# Altium schematic sheet Alimentacion.SchDoc
size A4; SheetNumber: 4; SheetTotal: 4
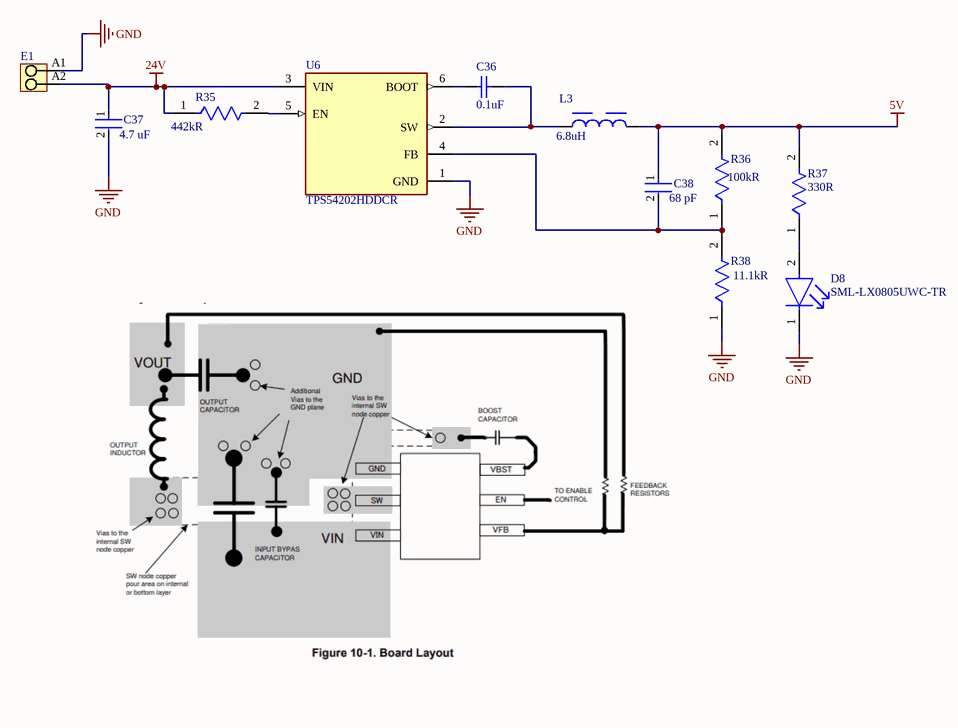
[diagram p0: Alimentacion.SchDoc]

## Parts
C36  value 0.1uF  [CAPC1005X60X30ML05T10]  (hidden comment: C0402C104M9RACTU)
C37  value 4.7 uF  [FP-CC0805-0_85-MFG]  (hidden comment: CC0805KKX5R9BB475)
C38  value 68 pF  [FP-C0402-BB-MFG]  (hidden comment: C0402C680J5HACTU)
D8  SML-LX0805UWC-TR  [FP-SML-LX0805UWC-TR-MFG]
E1  1330710000  [LMF_5_08_90_02]  (value not drawn)
L3  value 6.8uH  [WE-MAPI_3020]  (hidden comment: 74438336068HT)
R35  Resistance: 442kR  [FP-CRCW0603-e3-IPC_C]  (hidden comment: CRCW0603442KFKEC)
R36  Resistance: 100kR  [FP-CRGP0603-IPC_C]  (hidden comment: CRGP0603F100K)
R37  Resistance: 330R  [FP-AC0603-IPC_C]  (hidden comment: AC0603JR-07330RL)
R38  value 11.1kR  [FP-RN73R1E-IPC_A]  (hidden comment: RN73R1ETTP1112B25)
U6  TPS54202HDDCR  [FP-DDC0006A-IPC_B]

## Nets
5V: C38.1 L3.2 R36.2 R37.2
24V: C37.1 E1.A2 R35.1 U6.3(VIN)
GND: C37.2 D8.1(C) E1.A1 R38.1 U6.1(GND)
NetC36_1: C36.1 L3.1 U6.2(SW)
NetC36_2: C36.2 U6.6(BOOT)
NetC38_2: C38.2 R36.1 R38.2 U6.4(FB)
NetD8_2: D8.2(A) R37.1
NetR35_2: R35.2 U6.5(EN)

## Library data of the parts
C36 = CMP-2008-02199-1: Manufacturer: Kemet; Part Number: C0402C104M9RACTU
C37 = CMP-03422-000966-1: CAP CER 4.7UF 50V X5R 0805; Manufacturer: Yageo; Tolerance: 0.1; Material: Ceramic; Capacitance: 4.7 uF; Height: 0.95mm; Category: Cap; Manufacturer Part Number: CC0805KKX5R9BB475; ComponentLink2Description: Datasheet; Lead Free: Yes; Voltage Rating: 50 V; Device Class L2: Capacitors; Temperature Range High: +85°C; ComponentLink2URL: http://www.yageo.com/documents/recent/UPY-GPHC_Y5V_6.3V-to-50V_8.pdf; Ipc Land Pattern Name: CAPC200125X85; Octopart: https://octopart.com/cc0805kkx5r9bb475-yageo-81932641; Temperature Range Low: -30°C; Digikey Description: CAP CER 4.7UF 50V X5R 0805; Package: CC0805-0.85; Device Class L1: Passive Components; RoHS: TRUE; Temperature Characteristic: X5R; Device Class L3: Ceramic Capacitors; Automotive: No; Temperature: -30°C to +85°C; Footprint Url: http://www.yageo.com/exep/pages/download/literatures/UPY-C_GEN_24.pdf
C38 = CMP-03020-011520-1: C0402 68 pF X8R 5.00% 50 V; Manufacturer: Kemet; Tolerance: 0.05; Material: Ceramic; Voltage Rating: 50 V; Temperature Coefficient: 15%; Automotive: No; Device Class L3: Ceramic Capacitors; Octopart: https://octopart.com/c0402c680j5hactu-kemet-88724668; Lead Free: Yes; Temperature Range High: +125°C; RoHS: TRUE; Ipc Land Pattern Name: CAPC10050X50; Device Class L1: Passive Components; ComponentLink2Description: Datasheet; Temperature Range Low: -55°C; Temperature: -55°C to +125°C; Height: 0.55mm; Manufacturer Part Number: C0402C680J5HACTU; Category: Cap; ComponentLink2URL: https://content.kemet.com/datasheets/KEM_C1002_X7R_SMD.pdf; Package: C0402-BB; Capacitance: 68 pF; Device Class L2: Capacitors; Temperature Characteristic: X8R
D8 = CMP-00229-00139794-1: SML-LX0805UWC-TR White LED, 0805 Diffused, Rectangle Lens SMD package; NexarPartId: 139794; Approvals: CSA, UL; Lens Color: Clear, Yellow; Luminous Intensity: 150mcd; Power Rating: 120mW; Forward Current: 20mA; Forward Voltage: 3.5V; Number of LEDs: 1; Viewing Angle: 120°; RoHS: Compliant; Case/Package: 0805; Illumination Color: White; Min Operating Temperature: -40°C; Mount: Surface Mount; Max Operating Temperature: 85°C
E1 = CMP-1559-01844-1: OMNIMATE Signal - series LMF; Manufacturer: Weidmueller; Contact_material: CuSn; Rated_current_use_group_B_UL_1059: 20 A; No_of_poles: 2; Wire_cross_section_AWG_max_UL_1059: AWG 12; Solid_max_H05_07_V_U: 2,5 mm²; Contact_surface: tinned; Pitch_inch: 0,2 inch; Solid_min_H05_07_V_U: 0,2 mm²; UL_94_flammability_rating: V-0; Short_text_for_material: LMF 5.08/02/90 3.5SN OR BX; Rated_voltage_for_surge_voltage_class_pollution_degree_II_2: 400 V; Solder_pin_length_mm: 3,5 mm; Pitch_mm: 5,08 mm; Rated_voltage_use_group_B_UL_1059: 300 V; Wire_cross_section_AWG_min_UL_1059: AWG 26; Insulating_material: Wemid (PA); Rated_current_min_no_of_poles_TU_20_deg_C: 32 A; PackageReference: LMF_5_08_90_02; ComponentLink2URL: http://catalog.weidmueller.com/catalog/Start.do?localeId=en&ObjectID=1330710000; Packaging: Box; Revision: V1; Qty: 130 PCS; ComponentLink1URL: http://www.weidmueller.com/; PartNumber: 1330710000; ComponentLink1Description: Manufacturer URL; ComponentLink2Description: URL Link1; Colour: Orange
L3 = CMP-03913-147411463-1: Power Inductor, 6.8UH, Shielded, 2A Rohs Compliant: Yes
R35 = CMP-02407-001837-1: RES Thick Film, 442kΩ, 1%, 0.1W, 100ppm/°C, 0603; Max Power Dissipation: 100mW; Height: 0.02inch; Composition: Thick Film; Temperature Coefficient: 100ppm/°C; Radiation Hardening: No; Packaging: Tape and Reel; Max Operating Temperature: 155°C; Package Quantity: 20000; Contact Plating: Tin; Case/Package: 0603; Features: Automotive AEC-Q200; Min Operating Temperature: -55°C; Lead Free: Lead Free; Width: 0.033inch; Length: 0.061inch; Number of Terminations: 2; Tolerance: 1%
R36 = CMP-03211-000885-1: CRGP 0603 100K 1%; Manufacturer: TE; Power Rating: 0.25W; Voltage Rating: 50V; Value: 100KΩ; Tolerance: 0.01; Temperature Coefficient: ±100ppm/°C; Device Class L2: Resistors; Temperature: -55°C to +155°C; Temperature Range High: +155°C; Ambient Temperature Range High: +70°C; Lead Free: Yes; RoHS: TRUE; Octopart: https://octopart.com/crgp0603f100k-te+connectivity-91018719; Digikey Description: CRGP 0603 100K 1%; Automotive: No; Manufacturer Part Number: CRGP0603F100K; ComponentLink2Description: Datasheet; Category: Res; Ipc Land Pattern Name: RESC16080X45; Device Class L3: Chip SMD Resistors; Composition: Thick Film; Temperature Range Low: -55°C; Height: 0.55mm; Device Class L1: Passive Components; Series: CRGP; Package: CRGP0603; ComponentLink2URL: https://www.te.com/commerce/DocumentDelivery/DDEController?Action=srchrtrv&DocNm=9-1773463-9&DocType=DS&DocLang=English
R37 = CMP-03412-039929-1: RES 330Ω 5.00% 0.1W 0603; Voltage Rating: 50V; Power Rating: 100mW; Tolerance: 5%; Temperature Coefficient: 100ppm/°C; Series: AC; Case/Package: 0603; Weight: 7.1E-05oz; Min Operating Temperature: -55°C; Ratings: AEC-Q200; Width: 0.8mm; Resistor Type: Thick Film; Termination: SMD/SMT; Number of Terminations: 2; Max Power Dissipation: 100mW; Case Code (Imperial): 0603; Case Code (Metric): 1608; Height: 0.45mm; Max Operating Temperature: 155°C; Length: 1.6mm; RoHS Compliant: Yes; Features: Moisture Resistant; Packaging: Tape and Reel
R38 = CMP-04015-027552-1: 11.1kΩ ±0.1% 0.063W, 1/16W Chip Resistor 0402 (1005 Metric) Moisture Resistant Thin Film
U6 = CMP-04918-000212-1: IC REG BUCK ADJ 2A TSOT23-6; Min Output Voltage: 596mV; Number of Outputs: 1; Max Input Voltage: 28V; Switching Frequency: 500kHz; Output Configuration: Positive; Min Input Voltage: 4.5V; Synchronous Rectifier: Yes; Output Type: Adjustable; Quiescent Current: 40uA; Case/Package: SOT-23-6; Output Current: 2A; Mount: Surface Mount; Min Operating Temperature: -40°C; Max Output Voltage: 28V; Max Operating Temperature: 125°C; Lead Free: Lead Free; Packaging: Tape and Reel; RoHS Compliant: Yes